# Altium schematic sheet Power supply.SchDoc
size A4
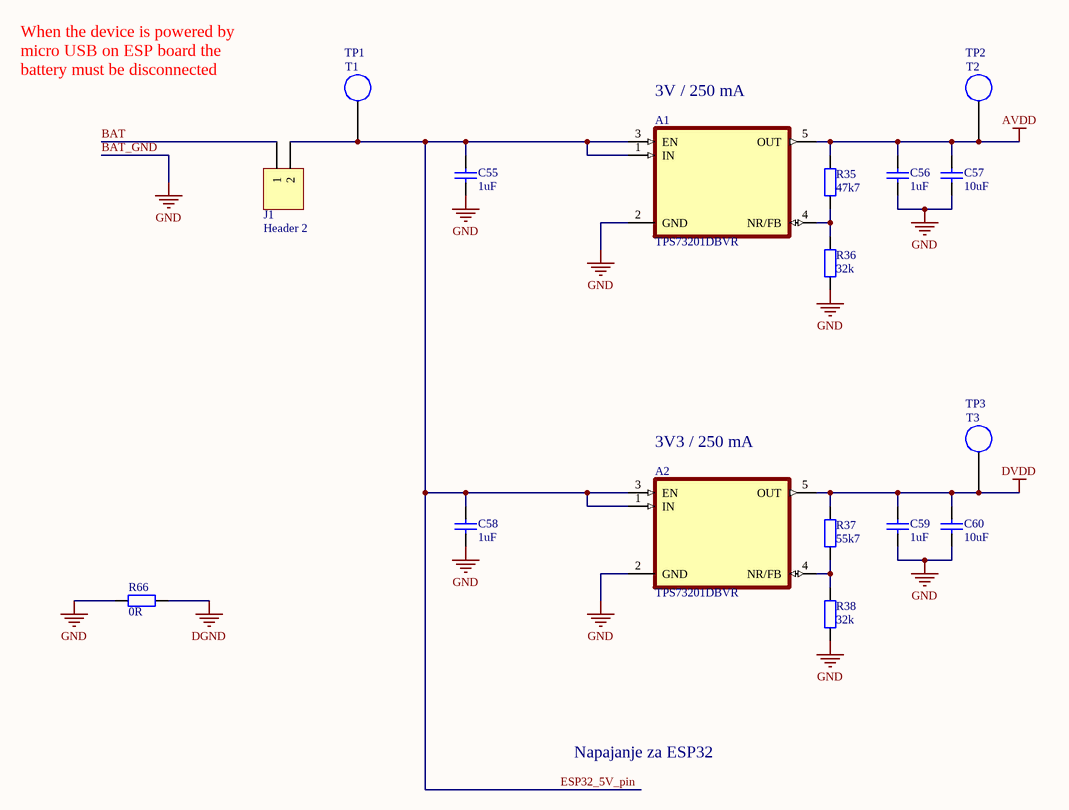
[diagram p0: Power supply.SchDoc]

## Parts
A1  TPS73201DBVR  [SOT95P280X145-5N]
A2  TPS73201DBVR  [SOT95P280X145-5N]
C55  1uF  [C0603]
C56  1uF  [C0603]
C57  10uF  [C0603]
C58  1uF  [C0603]
C59  1uF  [C0603]
C60  10uF  [C0603]
J1  Header 2  [HDR1X2]
R35  47k7  [RES0603]
R36  32k  [RES0603]
R37  55k7  [RES0603]
R38  32k  [RES0603]
R66  0R  [RES0603]
T1  TP1  [PCBComponent_1]
T2  TP2  [PCBComponent_1]
T3  TP3  [PCBComponent_1]

## Nets
AVDD: A1.5(OUT) C56.2 C57.2 R35.2 T2.1
BAT_GND: A1.2(GND) A2.2(GND) C55.1 C56.1 C57.1 C58.1 C59.1 C60.1 R36.1 R38.1 R66.2  [also labelled GND]
DGND: R66.1
DVDD: A2.5(OUT) C59.2 C60.2 R37.2 T3.1
BAT: J1.1
ESP32_5V_pin: A1.1(IN) A1.3(EN) A2.1(IN) A2.3(EN) C55.2 C58.2 J1.2 T1.1
NetA1_4: A1.4(NR/FB) R35.1 R36.2
NetA2_4: A2.4(NR/FB) R37.1 R38.2

## Notes on the sheet
- When the device is powered by micro USB on ESP board the battery must be disconnected
- (near A1) 3V / 250 mA
- (near A2) 3V3 / 250 mA
- Napajanje za ESP32

## Library data of the parts
A1 A2 = TPS73201DBVR: 250-mA, high-accuracy, ultra-low-dropout voltage regulator with reverse current protection & enable 5-SOT-23 -40 to 125; MF: Texas Instruments; DigiKey-Purchase-URL: https://snapeda.com/shop?store=DigiKey&id=76590; Package: SOT-23-5 Texas Instruments; Mouser-Purchase-URL: https://snapeda.com/shop?store=Mouser&id=76590; Texas_Instruments-Purchase-URL: https://snapeda.com/shop?store=Texas+Instruments&id=76590; MP: TPS73201DBVR; SnapEDA_Link: https://www.snapeda.com/parts/TPS73201DBVR/Texas%20Instruments/view-part/76590/?ref=snap; Arrow_Electronics-Purchase-URL: https://snapeda.com/shop?store=Arrow+Electronics&id=76590; Value: *
C55-C60 = Cap: Capacitor; Value: 100pF; Published: 8-Jun-2000; LatestRevisionDate: 17-Jul-2002; LatestRevisionNote: Re-released for DXP Platform.; PackageReference: RAD-0.3; Publisher: Altium Limited; PackageDescription: Radial Cap, Thru-Hole; 2 Leads; 0.3 in Pin Spacing
J1 = Header 2: Header, 2-Pin; LatestRevisionDate: 17-Jul-2002; LatestRevisionNote: Re-released for DXP Platform.; Publisher: Altium Limited
R35-R38 R66 = Res2: Resistor; Value: 1K; Published: 8-Jun-2000; LatestRevisionDate: 17-Jul-2002; LatestRevisionNote: Re-released for DXP Platform.; PackageReference: AXIAL-0.4; Publisher: Altium Limited; PackageDescription: Axial Device, Thru-Hole; 2 Leads; 0.4 in Pin Spacing
T1-T3 = Component_1